# Altium project Buck.PrjPcb
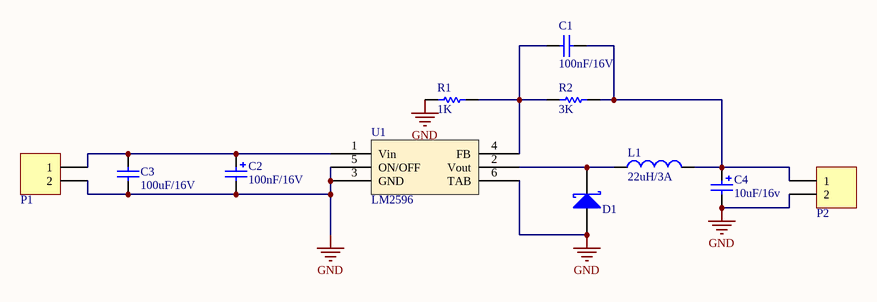
[diagram p0: Buck.SchDoc]
1 sheet, 11 parts. Net scope: global (net labels, ports and power ports of the same name join across sheets).
Board file: Buck.PcbDoc

## Sheet Buck.SchDoc
size Letter

### Parts
C1  value 100nF/16V  [CAP-SM-0603]  (hidden comment: Cap Non-Pol SMD)
C2  value 100nF/16V  [CP1.5/3.4]  (hidden comment: Cap Pol)
C3  value 100uF/16V  [CAP-SM-0603]  (hidden comment: Cap Non-Pol SMD)
C4  value 10uF/16v  [CP1.5/3.4]  (hidden comment: Cap Pol)
D1  D Schottky  [SS34]  (value not drawn)
L1  value 22uH/3A  [INDUCTOR 12.5x12.5]  (hidden comment: Inductor)
P1  Domino 2  [DOMINO 2- 5mm]  (value not drawn)
P2  Domino 2  [DOMINO 2- 5mm]  (value not drawn)
R1  value 1K  [RES-SM-0603]  (hidden comment: RESISTOR SMD)
R2  value 3K  [RES-SM-0603]  (hidden comment: RESISTOR SMD)
U1  LM2596  [LM2596]

### Nets
GND: C2.2 C3.1 C4.2 D1.1(A) P1.2 P2.2 R1.1 U1.3(GND) U1.5(ON/OFF) U1.6(TAB)
NetC1_1: C1.1 R1.2 R2.1 U1.4(FB)
NetC1_2: C1.2 C4.1 L1.2 P2.1 R2.2
NetC2_1: C2.1 C3.2 P1.1 U1.1(Vin)
NetD1_2: D1.2(K) L1.1 U1.2(Vout)

### Library data of the parts
C1 C3 = Cap Non-Pol SMD: Capacitor
C2 C4 = Cap Pol: Polarized Capacitor (Radial)
D1 = D Schottky: Schottky Diode; Published: 8-Jun-2000; LatestRevisionDate: 17-Jul-2002; LatestRevisionNote: Re-released for DXP Platform.; PackageReference: SMB; Publisher: Altium Limited; PackageDescription: DO-214-AA/SMB; 2 C-Bend Leads; Body 5.3 x 3.6 mm, inc. leads (LxW); Code_JEDEC: DO-214-AA
P1 P2 = Domino 2: Domino, 2-Pin; LatestRevisionDate: 17-Jul-2002; LatestRevisionNote: Re-released for DXP Platform.; Publisher: Altium Limited
R1 R2 = RESISTOR SMD: Resistor
U1 = LM2596: SMD